# EAGLE design wifi_led (EAGLE 9.6.2)
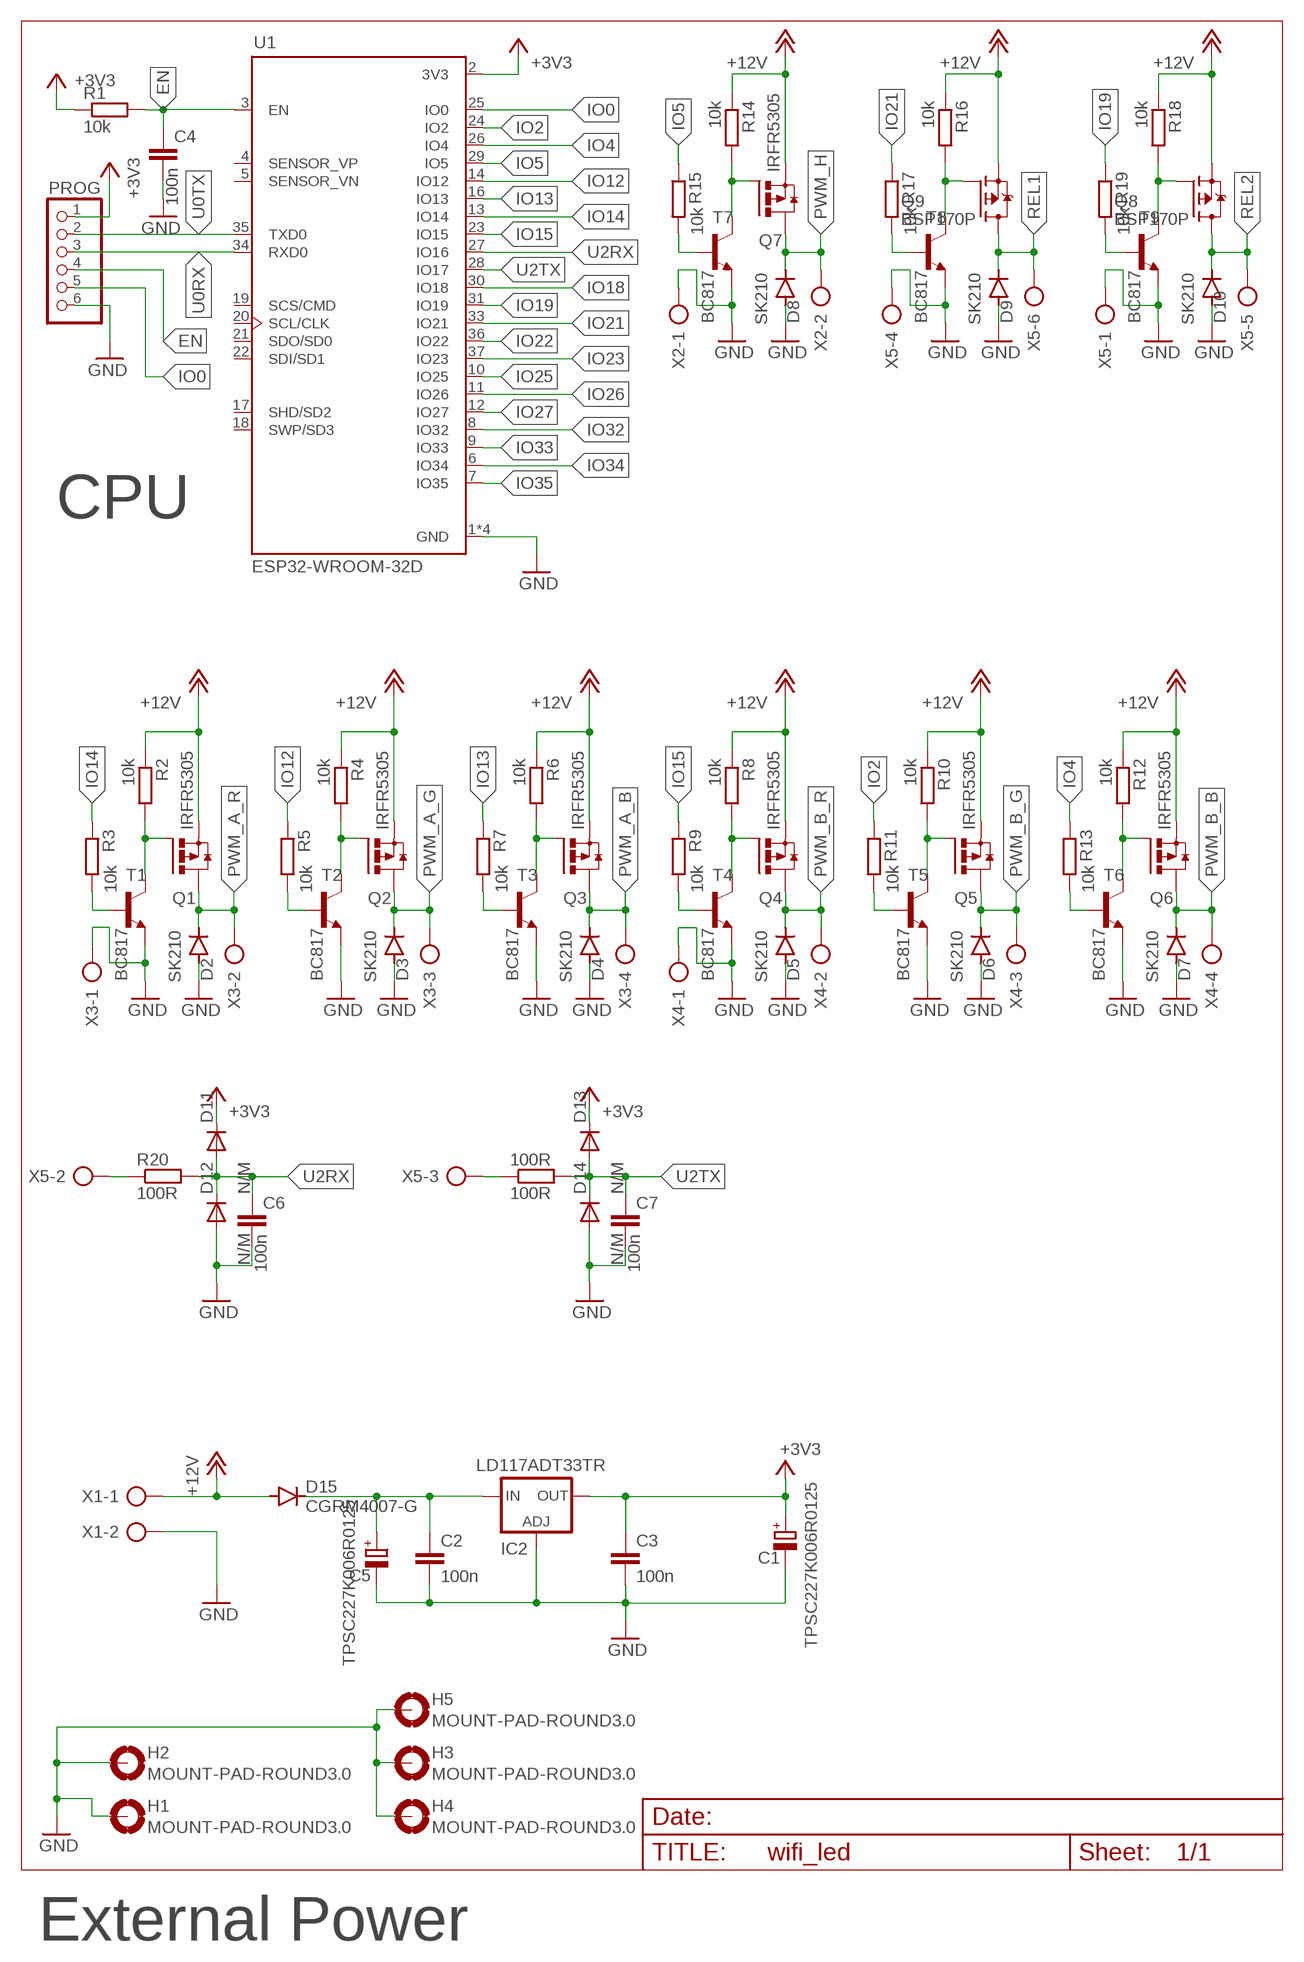
[diagram p0: schematic, sheet 1]

## Parts
100R  100R  R-EU_R0603  [R0603]
C1  TPSC227K006R0125  CPOL-EUCT6032  [CT6032]
C2  100n  C-EUC0603  [C0603]
C3  100n  C-EUC0603  [C0603]
C4  100n  C-EUC0603  [C0603]
C5  TPSC227K006R0125  CPOL-EUCT6032  [CT6032]
C6  100n  C-EUC0603  [C0603]
C7  100n  C-EUC0603  [C0603]
D2  SK210  DIODE-SMB  [SMB]
D3  SK210  DIODE-SMB  [SMB]
D4  SK210  DIODE-SMB  [SMB]
D5  SK210  DIODE-SMB  [SMB]
D6  SK210  DIODE-SMB  [SMB]
D7  SK210  DIODE-SMB  [SMB]
D8  SK210  DIODE-SMB  [SMB]
D9  SK210  DIODE-SMB  [SMB]
D10  SK210  DIODE-SMB  [SMB]
D11  N/M  DIODE-SMD0603  [0603]
D12  N/M  DIODE-SMD0603  [0603]
D13  N/M  DIODE-SMD0603  [0603]
D14  N/M  DIODE-SMD0603  [0603]
D15  CGRM4007-G  [SOD-123_MINI-SMA]
H1  MOUNT-PAD-ROUND3.0  [3,0-PAD]
H2  MOUNT-PAD-ROUND3.0  [3,0-PAD]
H3  MOUNT-PAD-ROUND3.0  [3,0-PAD]
H4  MOUNT-PAD-ROUND3.0  [3,0-PAD]
H5  MOUNT-PAD-ROUND3.0  [3,0-PAD]
IC2  LD117ADT33TR  [DPACK]
PROG  PINHD-1X6  [1X06]
Q1  IRFR5305  [D-PAK]
Q2  IRFR5305  [D-PAK]
Q3  IRFR5305  [D-PAK]
Q4  IRFR5305  [D-PAK]
Q5  IRFR5305  [D-PAK]
Q6  IRFR5305  [D-PAK]
Q7  IRFR5305  [D-PAK]
Q8  BSP170P  [SOT223]
Q9  BSP170P  [SOT223]
R1  10k  R-EU_R0603  [R0603]
R2  10k  R-EU_R0603  [R0603]
R3  10k  R-EU_R0603  [R0603]
R4  10k  R-EU_R0603  [R0603]
R5  10k  R-EU_R0603  [R0603]
R6  10k  R-EU_R0603  [R0603]
R7  10k  R-EU_R0603  [R0603]
R8  10k  R-EU_R0603  [R0603]
R9  10k  R-EU_R0603  [R0603]
R10  10k  R-EU_R0603  [R0603]
R11  10k  R-EU_R0603  [R0603]
R12  10k  R-EU_R0603  [R0603]
R13  10k  R-EU_R0603  [R0603]
R14  10k  R-EU_R0603  [R0603]
R15  10k  R-EU_R0603  [R0603]
R16  10k  R-EU_R0603  [R0603]
R17  10k  R-EU_R0603  [R0603]
R18  10k  R-EU_R0603  [R0603]
R19  10k  R-EU_R0603  [R0603]
R20  100R  R-EU_R0603  [R0603]
T1  BC817  BC817-16-NPN-SOT23-BEC  [SOT23-BEC]
T2  BC817  BC817-16-NPN-SOT23-BEC  [SOT23-BEC]
T3  BC817  BC817-16-NPN-SOT23-BEC  [SOT23-BEC]
T4  BC817  BC817-16-NPN-SOT23-BEC  [SOT23-BEC]
T5  BC817  BC817-16-NPN-SOT23-BEC  [SOT23-BEC]
T6  BC817  BC817-16-NPN-SOT23-BEC  [SOT23-BEC]
T7  BC817  BC817-16-NPN-SOT23-BEC  [SOT23-BEC]
T8  BC817  BC817-16-NPN-SOT23-BEC  [SOT23-BEC]
T9  BC817  BC817-16-NPN-SOT23-BEC  [SOT23-BEC]
U1  ESP32-WROOM-32D  [MODULE_ESP32-WROOM-32D]
X1  AK500/2  [AK500/2]
X2  AK500/2  [AK500/2]
X3  AK500/4  [AK500/4]
X4  AK500/4  [AK500/4]
X5  AK500/6  [AK500/6]

## Nets
+3V3: C1.+ C3.1 D11.2(C) D13.2(C) IC2.4(OUT) PROG.1 R1.1 U1.2(3V3)
+12V: D15.A Q1.3(S) Q2.3(S) Q3.3(S) Q4.3(S) Q5.3(S) Q6.3(S) Q7.3(S) Q8.3(S) Q9.3(S) R2.1 R4.1 R6.1 R8.1 R10.1 R12.1 R14.1 R16.1 R18.1 X1.1
EN: C4.1 PROG.4 R1.2 U1.3(EN)
GND: C1.- C2.2 C3.2 C4.2 C5.- C6.2 C7.2 D2.A D3.A D4.A D5.A D6.A D7.A D8.A D9.A D10.A D12.1(A) D14.1(A) H1.B3,0(MOUNT) H2.B3,0(MOUNT) H3.B3,0(MOUNT) H4.B3,0(MOUNT) H5.B3,0(MOUNT) IC2.1(ADJ) PROG.6 T1.E T2.E T3.E T4.E T5.E T6.E T7.E T8.E T9.E U1.1(GND) U1.15(GND) U1.38(GND) U1.39(GND) X1.2 X2.1 X3.1 X4.1 X5.1 X5.4
IO0: PROG.5 U1.25(IO0)
IO2: R11.1 U1.24(IO2)
IO4: R13.1 U1.26(IO4)
IO5: R15.1 U1.29(IO5)
IO12: R5.1 U1.14(IO12)
IO13: R7.1 U1.16(IO13)
IO14: R3.1 U1.13(IO14)
IO15: R9.1 U1.23(IO15)
IO18: U1.30(IO18)
IO19: R19.1 U1.31(IO19)
IO21: R17.1 U1.33(IO21)
IO22: U1.36(IO22)
IO23: U1.37(IO23)
IO25: U1.10(IO25)
IO26: U1.11(IO26)
IO27: U1.12(IO27)
IO32: U1.8(IO32)
IO33: U1.9(IO33)
IO34: U1.6(IO34)
IO35: U1.7(IO35)
N$1: C2.1 C5.+ D15.C IC2.3(IN)
N$2: Q2.1(G) R4.2 T2.C
N$3: R5.2 T2.B
N$4: Q3.1(G) R6.2 T3.C
N$5: R7.2 T3.B
N$6: Q4.1(G) R8.2 T4.C
N$7: R9.2 T4.B
N$8: Q5.1(G) R10.2 T5.C
N$9: R11.2 T5.B
N$10: Q6.1(G) R12.2 T6.C
N$11: R13.2 T6.B
N$12: Q7.1(G) R14.2 T7.C
N$13: R15.2 T7.B
N$14: Q9.1(G) R16.2 T8.C
N$15: R17.2 T8.B
N$16: Q8.1(G) R18.2 T9.C
N$17: R19.2 T9.B
N$18: R20.1 X5.2
N$19: 100R.1 X5.3
N$56: Q1.1(G) R2.2 T1.C
N$57: R3.2 T1.B
PWM_A_B: D4.C Q3.4(D) X3.4
PWM_A_G: D3.C Q2.4(D) X3.3
PWM_A_R: D2.C Q1.4(D) X3.2
PWM_B_B: D7.C Q6.4(D) X4.4
PWM_B_G: D6.C Q5.4(D) X4.3
PWM_B_R: D5.C Q4.4(D) X4.2
PWM_H: D8.C Q7.4(D) X2.2
REL1: D9.C Q9.2(D) Q9.4(D) X5.6
REL2: D10.C Q8.2(D) Q8.4(D) X5.5
U0RX: PROG.3 U1.34(RXD0)
U0TX: PROG.2 U1.35(TXD0)
U2RX: C6.1 D11.1(A) D12.2(C) R20.2 U1.27(IO16)
U2TX: 100R.2 C7.1 D13.1(A) D14.2(C) U1.28(IO17)
Unconnected: U1.4(SENSOR_VP) U1.5(SENSOR_VN) U1.17(SHD/SD2) U1.18(SWP/SD3) U1.19(SCS/CMD) U1.20(SCL/CLK) U1.21(SDO/SD0) U1.22(SDI/SD1)

## Notes on the sheet
- CPU
- External Power

## Library data of the parts
100R R1 R20 = rcl:R-EU_: RESISTOR, European symbol; SPICEPREFIX: R
C1 C5 = rcl:CPOL-EU: POLARIZED CAPACITOR, European symbol
C2-C4 C6 C7 = rcl:C-EU: CAPACITOR, European symbol
D2-D14 = diode:DIODE-: DIODE
D15 = diode:CGRM400*-G: Molded plasitc,JEDEC SOD-123/Mini SMA Source: Comchip CGRM4001-G.pdf
H1-H5 = holes:MOUNT-PAD-ROUND: MOUNTING PAD, round
IC2 = v-reg:LD117A?*: Low drop fixed and adjustable positive voltage regulators 1 A Source: http://www.st.com/stonline/products/literature/ds/7194/ld1117axx.pdf
PROG = pinhead:PINHD-1X6: PIN HEADER
Q1-Q7 = tranzystory IRF:IRFR5305
Q8 Q9 = transistor-fet:BSP170P: SIPMOS(R) Small-Signal-Transistor P-Channel, Enhancement mode Source: http://www.infineon.com/upload/Document/BSP170P_Rev2.4.pdf
R2-R19 = rcl:R-EU_: RESISTOR, European symbol
T1-T9 = transistor:*-NPN-: NPN Transistror BF959 corrected 2008.03.06
U1 = ESP32-WROOM-32D (1):ESP32-WROOM-32D: IC: SoC; GPIO, I2C, I2S, IR, SD, SDIO, SPI, UART; 2.7÷3.6VDC; 20dBm; AVAILABILITY: Unavailable; DESCRIPTION: IC: SoC; GPIO, I2C, I2S, IR, SD, SDIO, SPI, UART; 2.7÷3.6VDC; 20dBm; MF: Espressif Systems; MP: ESP32-WROOM-32D; PACKAGE: Module Espressif Systems; PRICE: None
X1 X2 = con-ptr500:AK500/2: CONNECTOR; OC_FARNELL: unknown; OC_NEWARK: unknown
X3 X4 = con-ptr500:AK500/4: CONNECTOR; OC_FARNELL: unknown; OC_NEWARK: unknown
X5 = con-ptr500:AK500/6: CONNECTOR; OC_FARNELL: unknown; OC_NEWARK: unknown

## Net classes
1 hv: clearance 0.33 mm

## Board
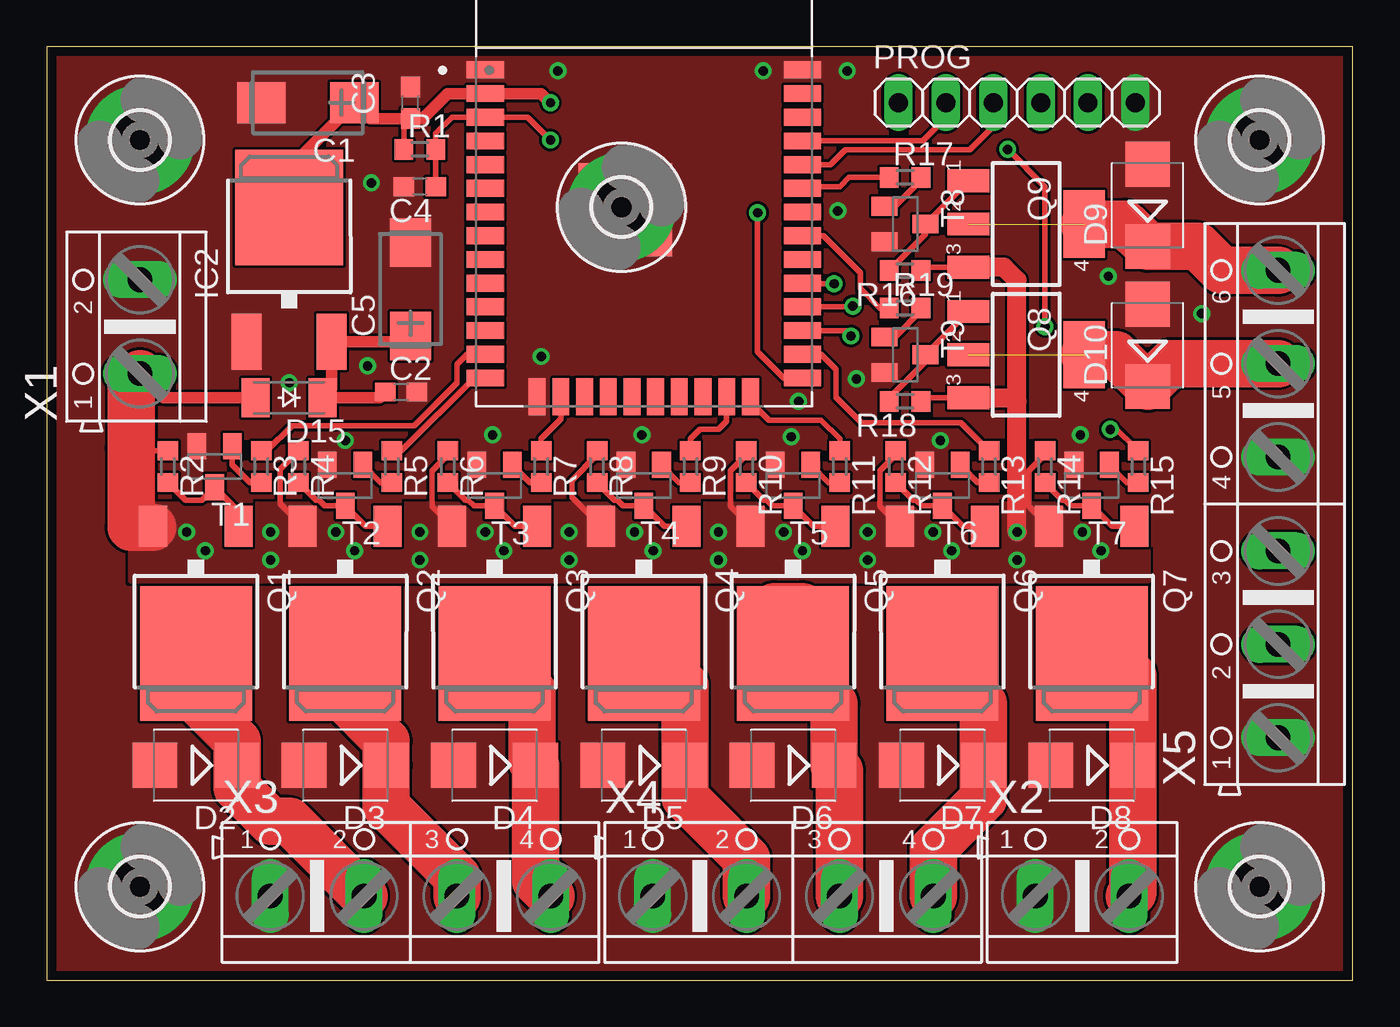
[diagram p1: board, top side]
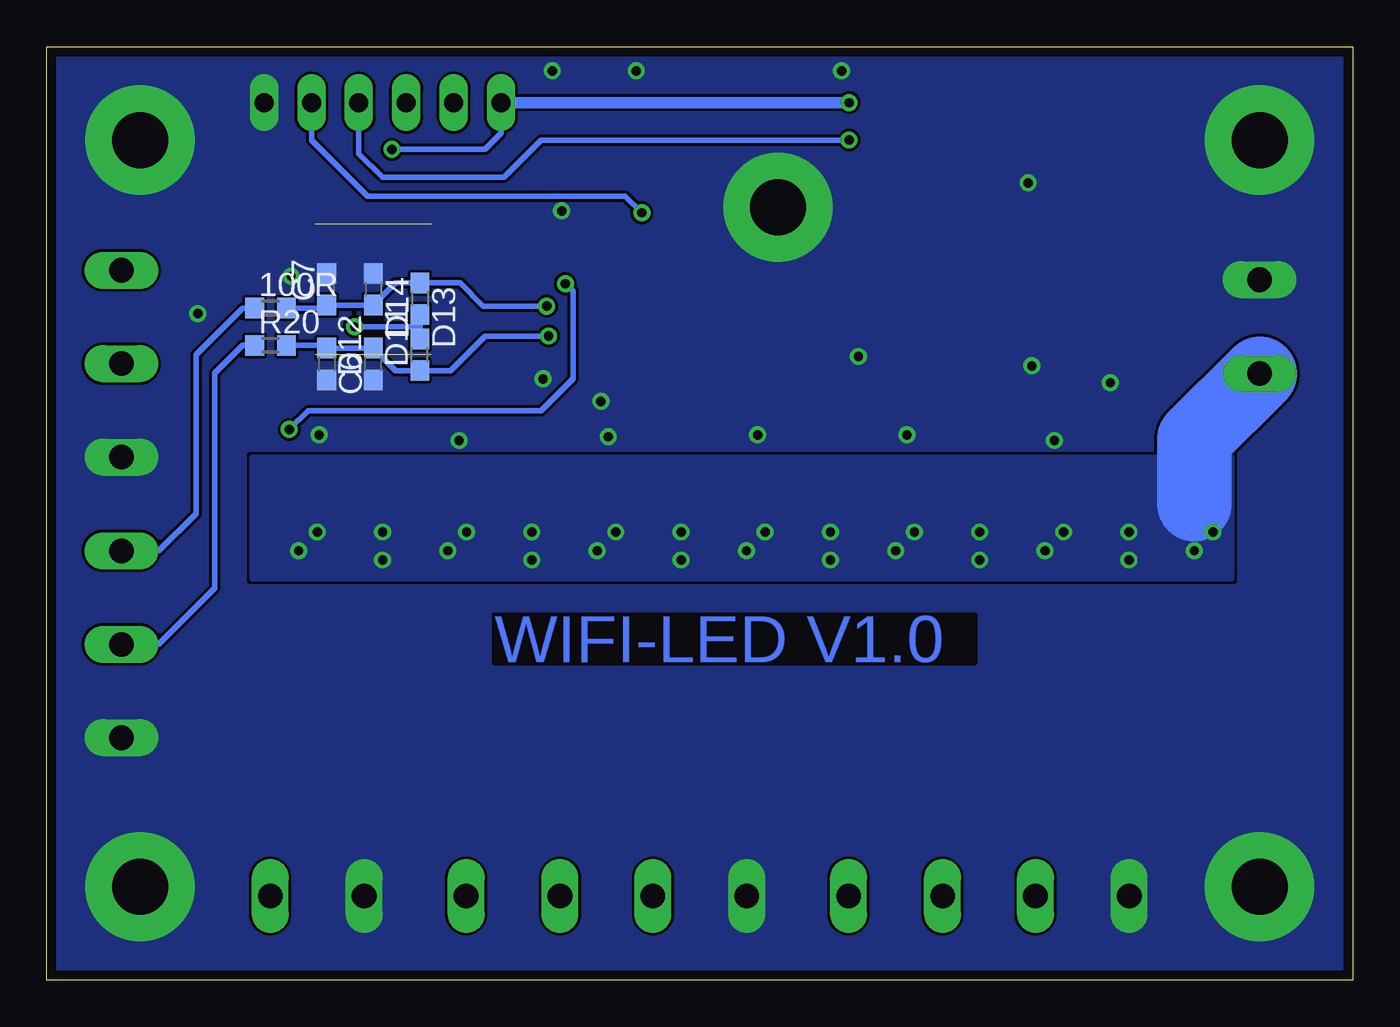
[diagram p2: board, bottom side, seen from below]

Size 70 x 50 mm. Coordinates in mm from the lower left corner, seen from the top.
Outline: 0,0 70,0 70,50 0,50 0,0
Copper layers (1*16): Top 0.035mm / dielectric 1.5mm / Bottom 0.035mm
Design rules "default *": minimum track width 6mil, minimum drill 0.35mm, track to track 6mil, track to pad 6mil, pad to pad 6mil, via to via 6mil, smd to smd 6mil, copper to edge 20mil, drill to drill 6mil, minimum pad ring 10mil, minimum via ring 8mil, stop-mask expansion 4mil, vias tented up to drill 0mil, thermal gap 10mil

### Footprints (pad centres in the part's own frame; a part is rotated, then mirrored left to right if it is on the bottom)
R0603 = smd 1 x 1.1: 1 -0.85,0; 2 0.85,0
CT6032 = smd 2.6 x 2.2: + -2.5,0; - 2.5,0
C0603 = smd 1.1 x 1: 1 -0.85,0; 2 0.85,0
SMB = smd 2.4 x 2.4: A 2.2,0; C -2.2,0
0603 = smd 1.1 x 1: 1 -0.85,0; 2 0.85,0
SOD-123_MINI-SMA = smd 1.5 x 2.1: A 1.8,0; C -1.8,0
3,0-PAD = drill 3 pad 5.842: B3,0 0,0
DPACK = smd 1.6 x 3: 1 -2.28,-4.8; 3 2.28,-4.8 | smd 5.8 x 6.2: 4 0,2.38
1X06 = drill 1.016 long: 1 -6.35,0; 2 -3.81,0; 3 -1.27,0; 4 1.27,0; 5 3.81,0; 6 6.35,0
D-PAK = smd 1.5 x 2.2: 1 -2.28,-4.8; 3 2.28,-4.8 | smd 6 x 7.2: 4 0,2
SOT223 = smd 1.219 x 2.235: 1 -2.311,-3.099; 2 0,-3.099; 3 2.311,-3.099 | smd 3.6 x 2.2: 4 0,3.099
SOT23-BEC = smd 1 x 1.4: B -0.95,-1.1; C 0,1.1; E 0.95,-1.1
MODULE_ESP32-WROOM-32D = smd 2 x 0.9: 1 -8.5,5.26; 2 -8.5,3.99; 3 -8.5,2.72; 4 -8.5,1.45; 5 -8.5,0.18; 6 -8.5,-1.09; 7 -8.5,-2.36; 8 -8.5,-3.63; 9 -8.5,-4.9; 10 -8.5,-6.17; 11 -8.5,-7.44; 12 -8.5,-8.71; 13 -8.5,-9.98; 14 -8.5,-11.25; 25 8.5,-11.25; 26 8.5,-9.98; 27 8.5,-8.71; 28 8.5,-7.44; 29 8.5,-6.17; 30 8.5,-4.9; 31 8.5,-3.63; 32 8.5,-2.36; 33 8.5,-1.09; 34 8.5,0.18; 35 8.5,1.45; 36 8.5,2.72; 37 8.5,3.99; 38 8.5,5.26 | smd 0.9 x 2: 15 -5.715,-12.25; 16 -4.445,-12.25; 17 -3.175,-12.25; 18 -1.905,-12.25; 19 -0.635,-12.25; 20 0.635,-12.25; 21 1.905,-12.25; 22 3.175,-12.25; 23 4.445,-12.25; 24 5.715,-12.25 | smd 5 x 5: 39 -1,-2.24
AK500/2 = drill 1.321 long: 1 -2.515,0; 2 2.515,0
AK500/4 = drill 1.321 long: 1 -7.518,0; 2 -2.489,0; 3 2.489,0; 4 7.518,0
AK500/6 = drill 1.321 long: 1 -12.522,0; 2 -7.518,0; 3 -2.515,0; 4 2.515,0; 5 7.518,0; 6 12.522,0

### Placement (x,y rotation side)
100R  58,36 0 bottom
C1  14,47 180 top
C2  19,31.5 0 top
C3  19.5,47 90 top
C4  20,42.5 180 top
C5  19.5,37 90 top
C6  55,33 270 bottom
C7  55,37 90 bottom
D2  8,11.5 180 top
D3  16,11.5 180 top
D4  24,11.5 180 top
D5  32,11.5 180 top
D6  40,11.5 180 top
D7  48,11.5 180 top
D8  56,11.5 180 top
D9  59,41.5 90 top
D10  59,34 90 top
D11  50,33.5 90 bottom
D12  52.5,33 90 bottom
D13  50,36.5 270 bottom
D14  52.5,37 270 bottom
D15  13,31.2 180 top
H1  5,5 0 top
H2  65,5 0 top
H3  65,45 0 top
H4  5,45 0 top
H5  30.8,41.4 0 top
IC2  13,39 0 top
PROG  52,47 0 top
Q1  8,19.5 180 top
Q2  16,19.5 180 top
Q3  24,19.5 180 top
Q4  32,19.5 180 top
Q5  40,19.5 180 top
Q6  48,19.5 180 top
Q7  56,19.5 180 top
Q8  52.5,33.5 270 top
Q9  52.5,40.5 270 top
R1  20,44.5 0 top
R2  6.5,27.5 270 top
R3  11.5,27.5 270 top
R4  13.5,27.5 270 top
R5  18.5,27.5 270 top
R6  21.5,27.5 270 top
R7  26.5,27.5 270 top
R8  29.5,27.5 270 top
R9  34.5,27.5 270 top
R10  37.5,27.5 270 top
R11  42.5,27.5 270 top
R12  45.5,27.5 270 top
R13  50.5,27.5 270 top
R14  53.5,27.5 270 top
R15  58.5,27.5 270 top
R16  46,38 180 top
R17  46,43 0 top
R18  46,31 180 top
R19  46,36 0 top
R20  58,34 0 bottom
T1  9,27.5 180 top
T2  16,26.5 180 top
T3  24,26.5 180 top
T4  32,26.5 180 top
T5  40,26.5 180 top
T6  48,26.5 180 top
T7  56,26.5 180 top
T8  46,40.5 270 top
T9  46,33.5 270 top
U1  32,43.5 0 top
X1  5,35 90 top
X2  55.5,4.5 0 top
X3  19.5,4.5 0 top
X4  40,4.5 0 top
X5  66,25.5 90 top

### Tracks (layer width: path | path; a pad name or v marks a point on that pad's centre or on a via)
+3V3  (via drill 0.5)
  Top 0.305: R1.1 19.15,45.8 C3.1 | v51.5,44.5 53.5,42.5 v53.5,35
  Top 0.61: IC2.4 13,43.5 C1.+ 17.35,46.15 C3.1 20.15,46.15 21.49,47.49 U1.2 26.5,47.49 v26.99,47 v27,47
  Bottom 0.305: D13.2 D11.2 50,34.85 50.15,35 v53.5,35 | v51.5,44.5 46.5,44.5 45.65,45.35 PROG.1
  Bottom 0.61: v27,47 PROG.1
+12V  (via drill 0.5)
  Top 0.305: 5.01,32.5 X1.1 | Q2.3 12.5,25.52 12.5,27.35 R4.1 | R6.1 21.5,28.13 20.64,27.28 20.64,25.38 Q3.3 | R8.1 29.5,28.13 28.14,26.78 28.14,25.88 Q4.3 | R10.1 37.5,28.13 36.65,27.28 36.65,25.38 Q5.3 | R12.1 45.5,28.13 44.65,27.28 44.65,25.38 Q6.3 | R14.1 53.5,28.13 52.65,27.28 52.65,25.38 Q7.3 | R16.1 47.04,38.19 Q9.3 | R18.1 47.04,31.19 Q8.3 | R2.1 4.68,28.35 4.53,28.5
  Top 0.61: X1.1 6.29,31.2 D15.A
  Top 1.016: v52,24 52,31 | 52,31 52,37.5 51.31,38.19 Q9.3 | Q8.3 51.81,31.19 52,31
  Top 2.54: X1.1 4.53,32.01 4.53,28.5 4.53,24.25 5.67,24.25
  Bottom 4: X1.1 8.5,28.98 8.5,25.5
  other vias: 7.5,24 12,24 15.5,24 20,24 23.5,24 36,24 28,24 31.5,24 39.5,24 44,24 47.5,24 55.5,24 56.5,23 48.5,23 40.5,23 36,22.5 32.5,23 28,22.5 44,22.5 52,22.5 24.5,23 16.5,23 20,22.5 12,22.5 8.5,23
  pour Top (rank 2, no thermals): 4.5,25.5 59,25.5 59,21.4 4.5,21.4
  pour Bottom: 6.5,21.5 59,21.5 59,28 6.5,28
EN  (via drill 0.5)
  Top 0.305: C4.1 R1.2 20.85,45.35 21.72,46.22 U1.3 25.78,46.22 v27,45
  Bottom 0.305: v27,45 43.5,45 45.5,43 52,43 53.27,44.27 PROG.4
GND  (via drill 0.5)
  other vias: 39.9,29.1 31.9,29.2 23.9,29.2 16,28.9 47.9,28.9 55.4,29.2 17.4,42.7 40.3,31 27.4,48.7 26.5,33.4 17.2,32.9 13,32 38.4,48.7 42.9,48.7 43.4,32.2 42.4,41.2 56.9,37.7 61.9,35.7
  pour Top (rank 6, no thermals): 0,0 70,0 70,50 0,50
  pour Bottom (rank 6, no thermals): 0,0 70,0 70,50 0,50
IO0  (via drill 0.5)
  Top 0.305: U1.25 39.5,32.25 38.1,33.65 v38.1,41.1
  Bottom 0.305: PROG.5 55.81,45 52.81,42 39,42 v38.1,41.1
IO2
  Top 0.305: R11.1 42.5,29 41.5,30 38.7,30 37.72,30.98 U1.24
IO4
  Top 0.305: R13.1 49,29.85 43.67,29.85 42.3,31.22 42.3,32.72 41.5,33.52 U1.26
IO5  (via drill 0.5)
  Top 0.305: R15.1 57.17,29.68 v57,29.5 | U1.29 40.53,37.3 v42.2,37.3
  Bottom 0.305: v57,29.5 56,30.5 43.5,30.5 41.8,32.2 41.8,36.9 v42.2,37.3
IO12
  Top 0.305: U1.14 22.9,32.25 19,28.35 R5.1
IO13
  Top 0.305: U1.16 27.55,30.05 26.5,29 R7.1
IO14
  Top 0.305: R3.1 11.8,28.35 13.15,29.7 19.7,29.7 22,32 22,33 22.52,33.52 U1.13
IO15
  Top 0.305: U1.23 36.45,29.95 36,29.5 35,29.5 34.5,29 R9.1
IO19
  Top 0.305: R19.1 44.65,36 43.6,37.05 43.6,37.9 41.63,39.87 U1.31
IO21
  Top 0.305: U1.33 40.59,42.5 42.5,42.5 43,43 R17.1
N$1
  Top 0.61: 15.05,33.97 IC2.3 | C5.+ 19.2,34.2 IC2.3 | IC2.3 15.28,31.68 D15.C 17.85,31.2 C2.1
N$2
  Top 0.305: R4.2 14.45,25.7 14.6,25.7 14.9,25.4 T2.C 17.1,24.3 Q2.1
N$3
  Top 0.305: T2.B 17.9,26.65 R5.2
N$4
  Top 0.305: R6.2 22.45,25.7 22.6,25.7 22.9,25.4 T3.C 25.1,24.3 Q3.1
N$5
  Top 0.305: T3.B 25.9,26.65 R7.2
N$6
  Top 0.305: R8.2 30.45,25.7 30.6,25.7 30.9,25.4 T4.C 33.1,24.3 Q4.1
N$7
  Top 0.305: T4.B 33.9,26.65 R9.2
N$8
  Top 0.305: R10.2 38.45,25.7 38.6,25.7 38.9,25.4 T5.C 41.1,24.3 Q5.1
N$9
  Top 0.305: T5.B 41.9,26.65 R11.2
N$10
  Top 0.305: R12.2 46.45,25.7 46.6,25.7 46.9,25.4 T6.C 49.1,24.3 Q6.1
N$11
  Top 0.305: T6.B 49.9,26.65 R13.2
N$12
  Top 0.305: R14.2 54.45,25.7 54.6,25.7 54.9,25.4 T7.C 57.1,24.3 Q7.1
N$13
  Top 0.305: T7.B 57.9,26.65 R15.2
N$14
  Top 0.305: R16.2 47.1,39.95 T8.C Q9.1
N$15
  Top 0.305: T8.B 44.95,41.5 45.5,41.5 46.85,42.85 R17.2
N$16
  Top 0.305: Q8.1 T9.C 47.1,33.12 45.15,31.17 R18.2
N$17
  Top 0.305: T9.B 44.95,34.5 45.5,34.5 46.85,35.85 R19.2
N$18
  Bottom 0.305: X5.2 64,17.98 61,20.98 61,32.5 59.5,34 R20.1
N$19
  Bottom 0.305: X5.3 64,22.98 62,24.98 62,33.5 59.5,36 100R.1
N$56
  Top 0.305: R2.2 7.45,25.7 8.3,25.7 T1.C 10.28,25.12 Q1.1
N$57
  Top 0.305: T1.B 9.95,27.6 10.9,26.65 R3.2
PWM_A_B
  Top 2.54: X3.4 26.2,5.32 D4.C 26,11.7 26,15.5 Q3.4
PWM_A_G
  Top 2.54: X3.3 21.99,5.51 18.2,9.3 D3.C 18.2,12.8 15.75,15.25 16,15.5 Q2.4
PWM_A_R
  Top 2.54: X3.2 13.01,8.5 12,8.5 10.2,10.3 D2.C 10.2,12.8 7.75,15.25 8,15.5 Q1.4
PWM_B_B
  Top 2.54: X4.4 47.52,7.02 50.2,9.7 D7.C 50.2,14.8 48,17 Q6.4
PWM_B_G
  Top 2.54: X4.3 42.49,11.21 D6.C 42.2,14.8 39.5,17.5 39.5,19 40,19 40.5,18.5 | 40.5,18.5 40.5,18 | 40.5,18 39,18 39,20 40.5,20 40.5,18.5 | 40.5,18 Q5.4
PWM_B_R
  Top 2.54: X4.2 37.51,6.49 34.2,9.8 D5.C 34.2,15.8 31.5,18.5 31.5,18 Q4.4
PWM_H
  Top 2.54: X2.2 58.2,4.68 D8.C 58.2,16.3 57,17.5 Q7.4
REL1  (1 unrouted)
  Top 2.54: Q9.4 57.8,40.5 D9.C 61.7,39.3 62.98,38.02 X5.6
REL2  (1 unrouted)
  Top 2.54: Q8.4 57.3,33.5 D10.C 60.22,33.02 X5.5
U0RX
  Top 0.305: U1.34 42,43.68 42.8,44.48 49.48,44.48 50.73,45.73 PROG.3
U0TX
  Top 0.305: U1.35 46.95,44.95 48.19,46.19 PROG.2
U2RX  (via drill 0.5)
  Top 0.305: U1.27 42.81,34.79 v43.1,34.5
  Bottom 0.305: R20.2 55.15,34 C6.1 D12.2 51.3,32.65 D11.1 48.35,32.65 46.5,34.5 v43.1,34.5
U2TX  (via drill 0.5)
  Top 0.305: U1.28 43.16,36.06 v43.2,36.1
  Bottom 0.305: 100R.2 55.15,36 C7.1 D14.2 51.3,37.35 D13.1 47.85,37.35 46.6,36.1 v43.2,36.1

### Text on the board
Bottom: WIFI-LED V1.0